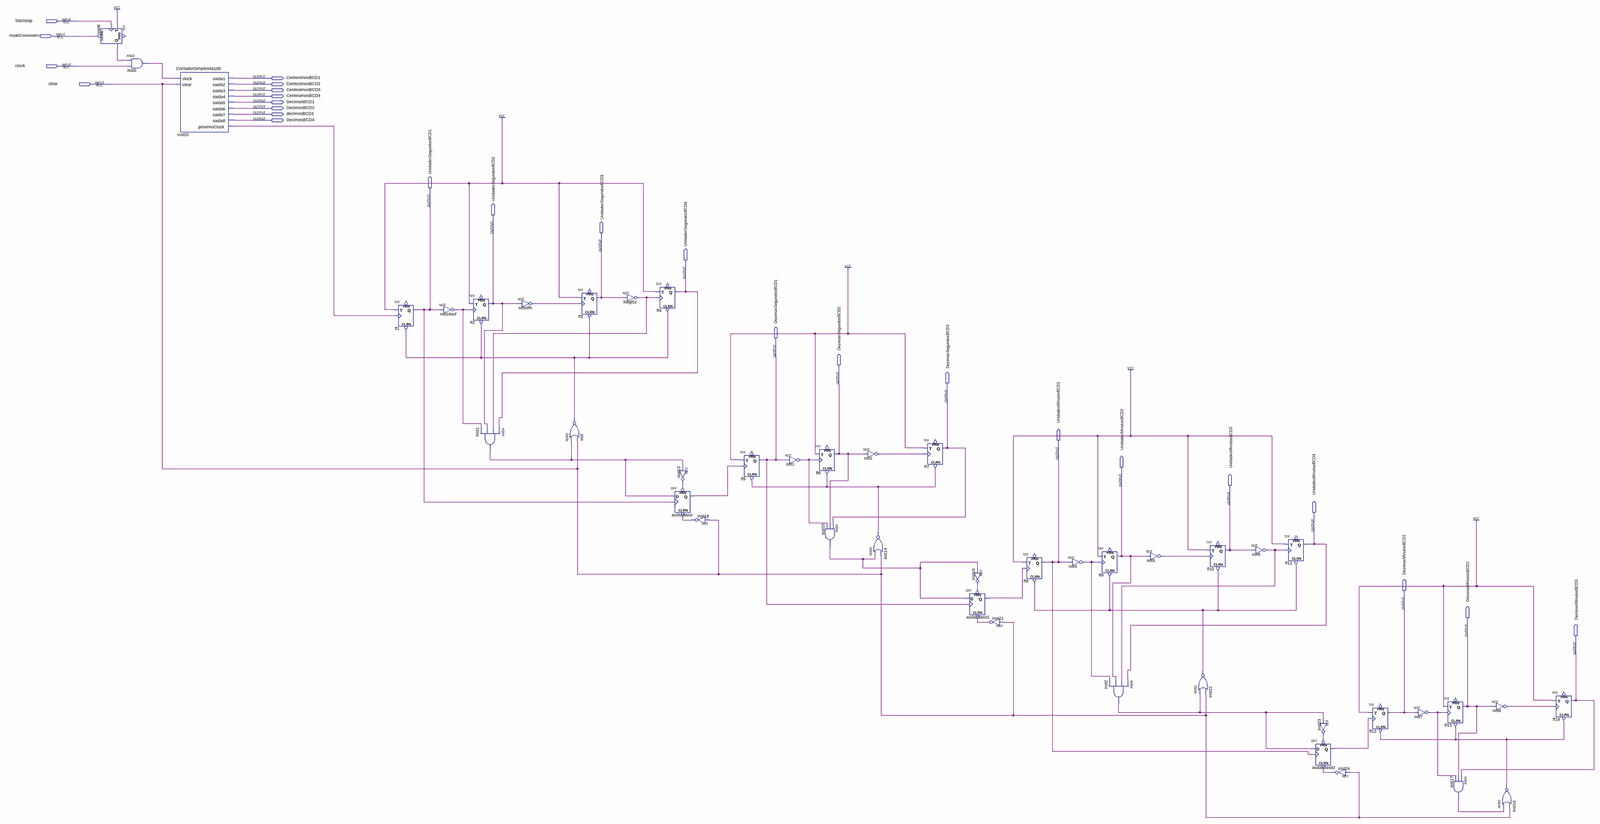
[diagram p0: schematic sheet, whole]
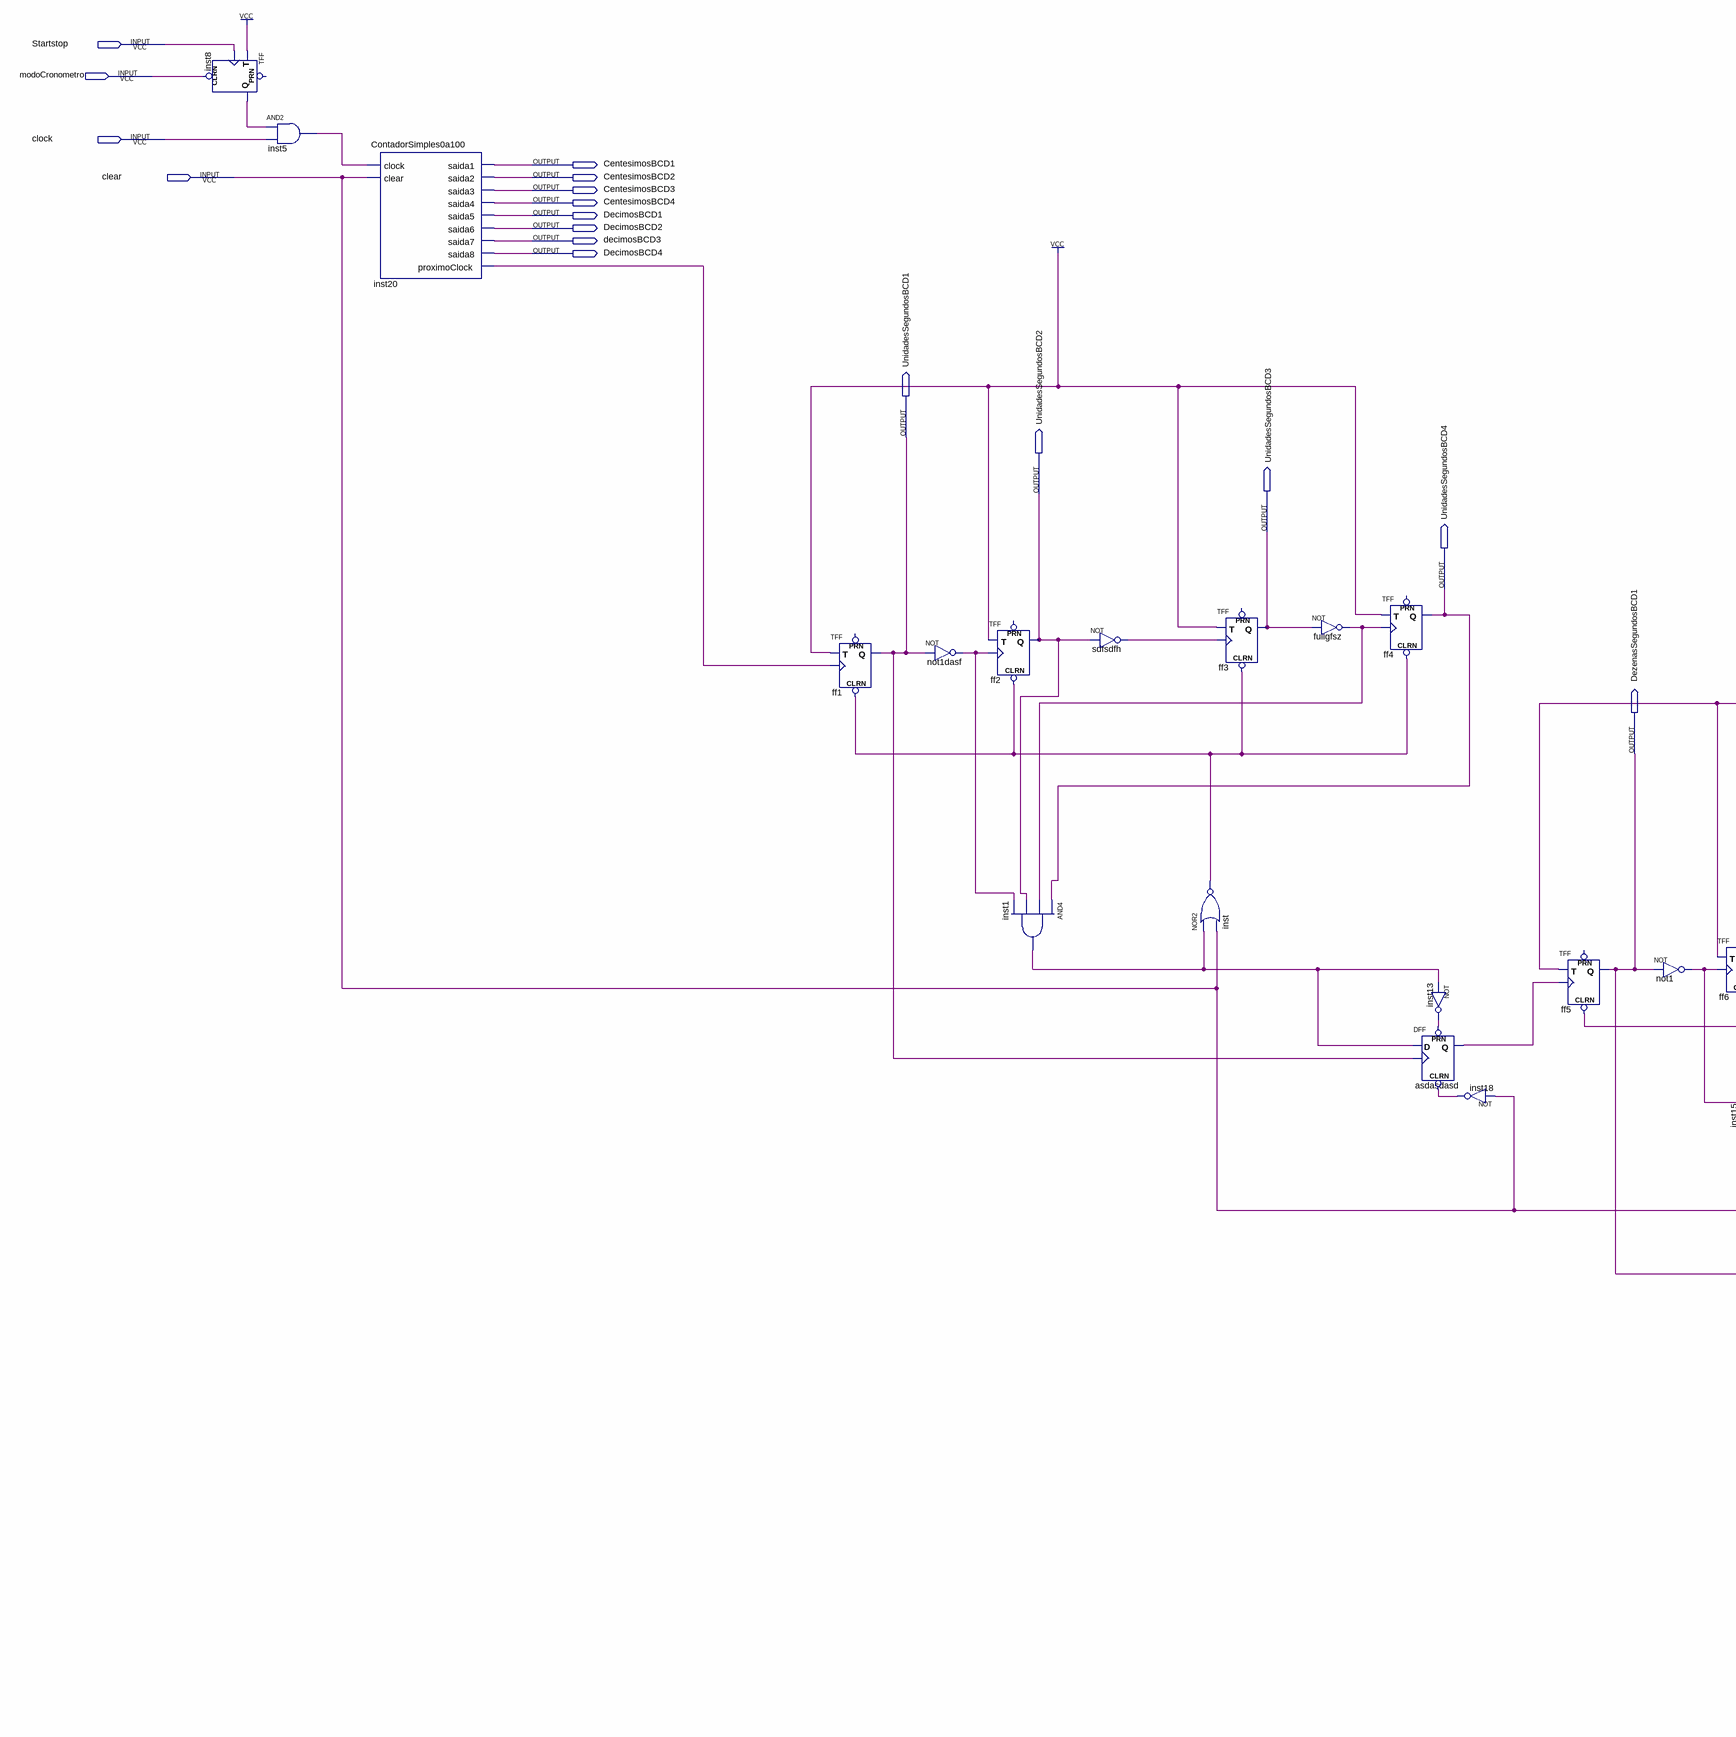
[diagram p1: schematic sheet, left part]
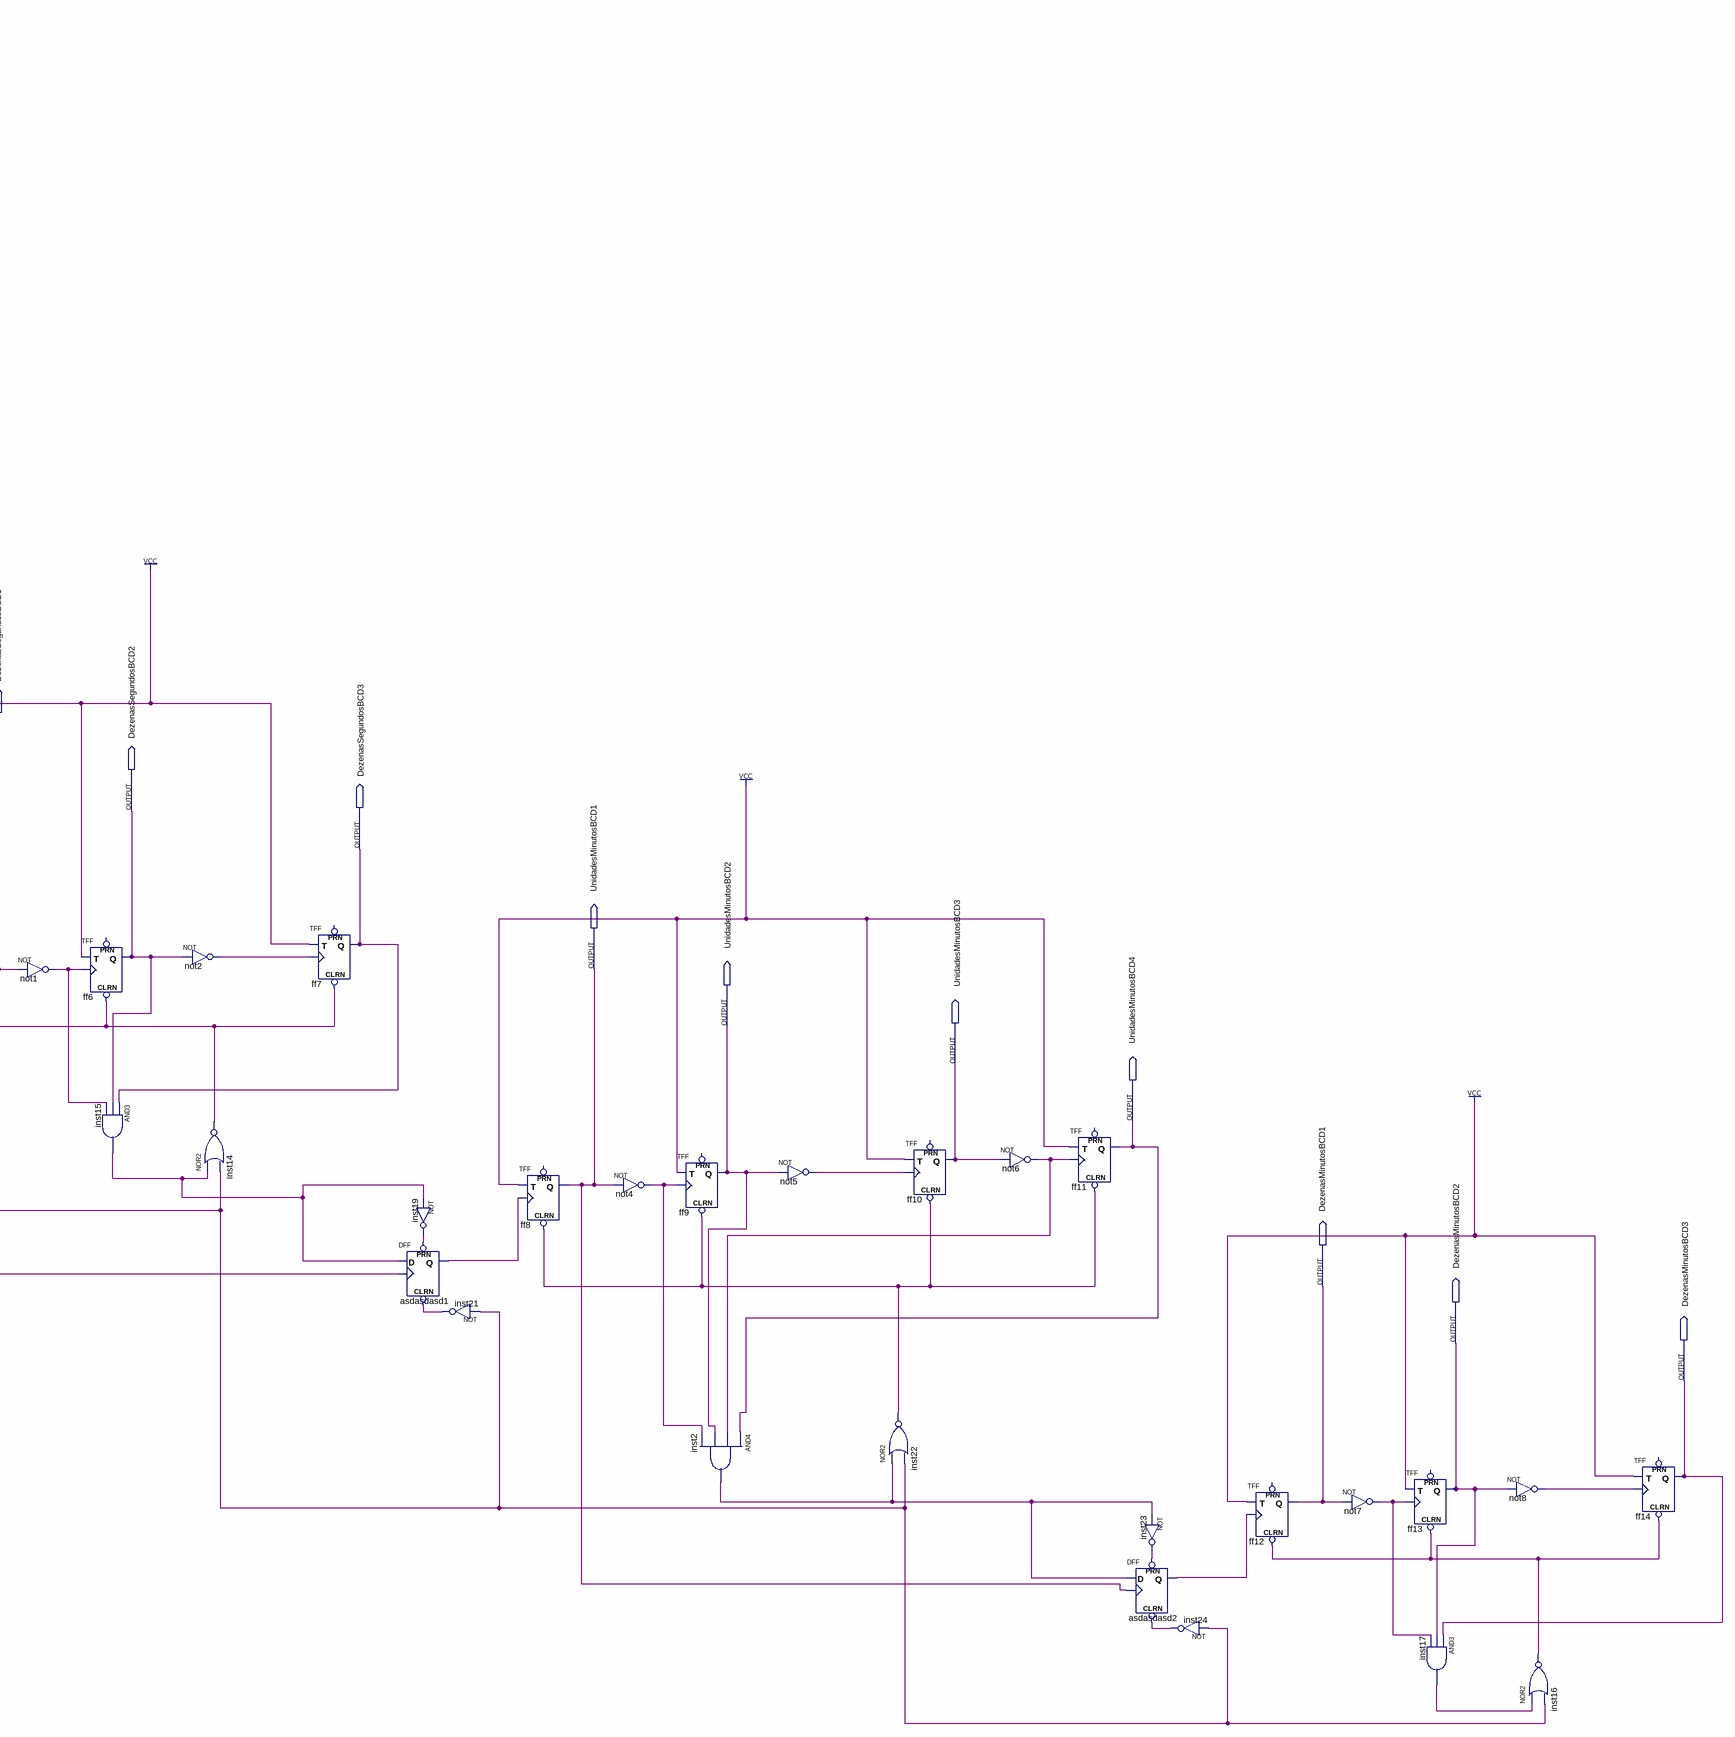
[diagram p2: schematic sheet, right part]
// Quartus schematic Backup.bdf as structural Verilog: 44 symbols, 26 pins
module Backup (
  input  Startstop,
  input  modoCronometro,
  input  clock,
  input  clear,
  output CentesimosBCD1,
  output CentesimosBCD2,
  output CentesimosBCD3,
  output CentesimosBCD4,
  output DecimosBCD1,
  output DecimosBCD2,
  output decimosBCD3,
  output DecimosBCD4,
  output UnidadesSegundosBCD1,
  output UnidadesSegundosBCD2,
  output UnidadesSegundosBCD3,
  output UnidadesSegundosBCD4,
  output DezenasSegundosBCD1,
  output DezenasSegundosBCD2,
  output DezenasSegundosBCD3,
  output UnidadesMinutosBCD1,
  output UnidadesMinutosBCD2,
  output UnidadesMinutosBCD3,
  output UnidadesMinutosBCD4,
  output DezenasMinutosBCD1,
  output DezenasMinutosBCD2,
  output DezenasMinutosBCD3
);

  wire asdasdasd1_q, asdasdasd2_q, asdasdasd_q, fuilgfsz_out, inst1_out, inst2_out, inst5_out, inst8_q,
       inst13_out, inst14_out, inst15_out, inst16_out, inst17_out, inst18_out, inst19_out,
       inst20_proximoclock, inst21_out, inst22_out, inst23_out, inst24_out, inst_out, not1_out, not1dasf_out,
       not2_out, not4_out, not5_out, not6_out, not7_out, not8_out, sdfsdfh_out;

  TFF inst8 (.CLRN(modoCronometro), .T(1'b1), .CLK(Startstop), .Q(inst8_q));  // open: PRN
  and inst5 (inst5_out, inst8_q, clock);
  ContadorSimples0a100 inst20 (
    .clock(inst5_out), .clear(clear), .saida1(CentesimosBCD1), .saida2(CentesimosBCD2),
    .saida3(CentesimosBCD3), .saida4(CentesimosBCD4), .saida5(DecimosBCD1), .saida6(DecimosBCD2),
    .saida7(decimosBCD3), .saida8(DecimosBCD4), .proximoClock(inst20_proximoclock));
  TFF ff1 (.CLRN(inst_out), .T(1'b1), .CLK(inst20_proximoclock), .Q(UnidadesSegundosBCD1));  // open: PRN
  not not1dasf (not1dasf_out, UnidadesSegundosBCD1);
  TFF ff2 (.CLRN(inst_out), .T(1'b1), .CLK(not1dasf_out), .Q(UnidadesSegundosBCD2));  // open: PRN
  and inst1 (inst1_out, UnidadesSegundosBCD4, fuilgfsz_out, UnidadesSegundosBCD2, not1dasf_out);
  not sdfsdfh (sdfsdfh_out, UnidadesSegundosBCD2);
  nor inst (inst_out, inst1_out, clear);
  TFF ff3 (.CLRN(inst_out), .T(1'b1), .CLK(sdfsdfh_out), .Q(UnidadesSegundosBCD3));  // open: PRN
  not fuilgfsz (fuilgfsz_out, UnidadesSegundosBCD3);
  TFF ff4 (.CLRN(inst_out), .T(1'b1), .CLK(fuilgfsz_out), .Q(UnidadesSegundosBCD4));  // open: PRN
  not inst13 (inst13_out, inst1_out);
  DFF asdasdasd (.CLRN(inst18_out), .CLK(UnidadesSegundosBCD1), .D(inst1_out), .PRN(inst13_out), .Q(asdasdasd_q));
  not inst18 (inst18_out, clear);
  TFF ff5 (.CLRN(inst14_out), .T(1'b1), .CLK(asdasdasd_q), .Q(DezenasSegundosBCD1));  // open: PRN
  not not1 (not1_out, DezenasSegundosBCD1);
  TFF ff6 (.CLRN(inst14_out), .T(1'b1), .CLK(not1_out), .Q(DezenasSegundosBCD2));  // open: PRN
  and inst15 (inst15_out, DezenasSegundosBCD3, DezenasSegundosBCD2, not1_out);
  not not2 (not2_out, DezenasSegundosBCD2);
  nor inst14 (inst14_out, inst15_out, clear);
  TFF ff7 (.CLRN(inst14_out), .T(1'b1), .CLK(not2_out), .Q(DezenasSegundosBCD3));  // open: PRN
  not inst19 (inst19_out, inst15_out);
  DFF asdasdasd1 (.CLRN(inst21_out), .CLK(DezenasSegundosBCD1), .D(inst15_out), .PRN(inst19_out), .Q(asdasdasd1_q));
  not inst21 (inst21_out, clear);
  TFF ff8 (.CLRN(inst22_out), .T(1'b1), .CLK(asdasdasd1_q), .Q(UnidadesMinutosBCD1));  // open: PRN
  not not4 (not4_out, UnidadesMinutosBCD1);
  TFF ff9 (.CLRN(inst22_out), .T(1'b1), .CLK(not4_out), .Q(UnidadesMinutosBCD2));  // open: PRN
  and inst2 (inst2_out, UnidadesMinutosBCD4, not6_out, UnidadesMinutosBCD2, not4_out);
  not not5 (not5_out, UnidadesMinutosBCD2);
  TFF ff10 (.CLRN(inst22_out), .T(1'b1), .CLK(not5_out), .Q(UnidadesMinutosBCD3));  // open: PRN
  nor inst22 (inst22_out, inst2_out, clear);
  not not6 (not6_out, UnidadesMinutosBCD3);
  TFF ff11 (.CLRN(inst22_out), .T(1'b1), .CLK(not6_out), .Q(UnidadesMinutosBCD4));  // open: PRN
  DFF asdasdasd2 (.CLRN(inst24_out), .CLK(UnidadesMinutosBCD1), .D(inst2_out), .PRN(inst23_out), .Q(asdasdasd2_q));
  not inst23 (inst23_out, inst2_out);
  not inst24 (inst24_out, clear);
  TFF ff12 (.CLRN(inst16_out), .T(1'b1), .CLK(asdasdasd2_q), .Q(DezenasMinutosBCD1));  // open: PRN
  not not7 (not7_out, DezenasMinutosBCD1);
  TFF ff13 (.CLRN(inst16_out), .T(1'b1), .CLK(not7_out), .Q(DezenasMinutosBCD2));  // open: PRN
  and inst17 (inst17_out, DezenasMinutosBCD3, DezenasMinutosBCD2, not7_out);
  not not8 (not8_out, DezenasMinutosBCD2);
  nor inst16 (inst16_out, inst17_out, clear);
  TFF ff14 (.CLRN(inst16_out), .T(1'b1), .CLK(not8_out), .Q(DezenasMinutosBCD3));  // open: PRN
endmodule
